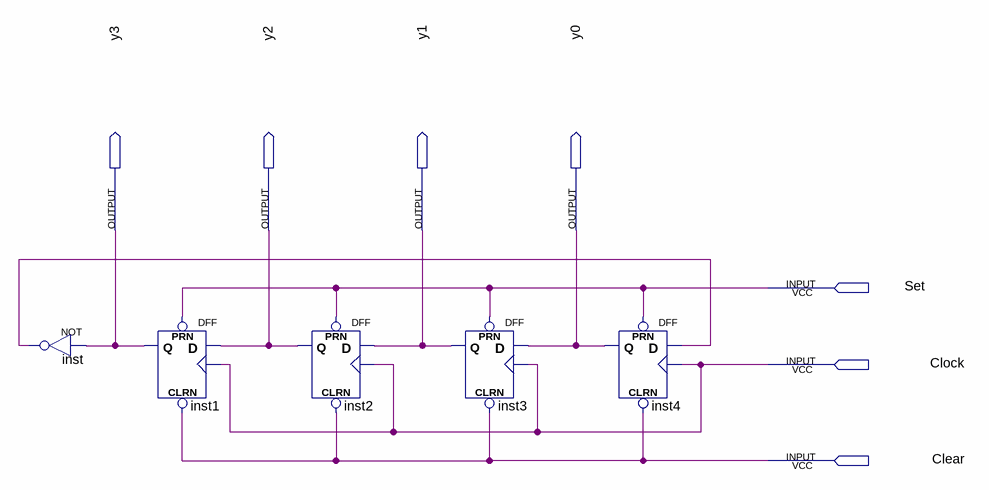
[diagram p0: schematic sheet]
// Quartus schematic TwistedRingCounter.bdf as structural Verilog: 5 symbols, 7 pins
module TwistedRingCounter (
  input  Set,
  input  Clock,
  input  Clear,
  output y3,
  output y2,
  output y1,
  output y0
);

  wire inst_out;

  not inst (inst_out, y3);
  DFF inst1 (.CLRN(Clear), .CLK(Clock), .D(y2), .PRN(Set), .Q(y3));
  DFF inst2 (.CLRN(Clear), .CLK(Clock), .D(y1), .PRN(Set), .Q(y2));
  DFF inst3 (.CLRN(Clear), .CLK(Clock), .D(y0), .PRN(Set), .Q(y1));
  DFF inst4 (.CLRN(Clear), .CLK(Clock), .D(inst_out), .PRN(Set), .Q(y0));
endmodule
